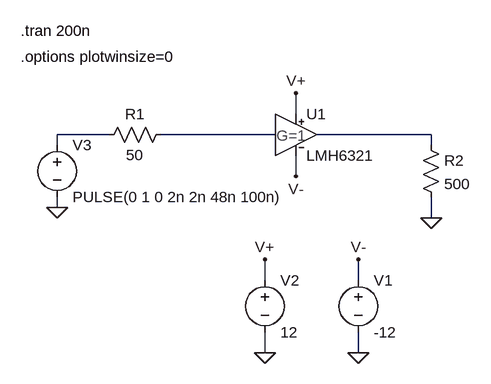
[diagram p0: schematic LM6321_test.asc]
LM6321_test.asc, the LTspice schematic file:
Version 4
SHEET 1 880 680
WIRE 96 160 96 128
WIRE -192 192 -272 192
WIRE 64 192 -112 192
WIRE 304 192 128 192
WIRE -272 208 -272 192
WIRE 304 208 304 192
WIRE 96 256 96 224
WIRE -272 304 -272 288
WIRE 304 320 304 288
WIRE 48 416 48 384
WIRE 192 416 192 384
WIRE 48 528 48 496
WIRE 192 528 192 496
FLAG -272 304 0
FLAG 192 528 0
FLAG 48 528 0
FLAG 48 384 V+
FLAG 192 384 V-
FLAG 96 128 V+
FLAG 96 256 V-
FLAG 304 320 0
SYMBOL LMH6321 96 128 R0
SYMATTR InstName U1
SYMBOL voltage 192 400 R0
SYMATTR InstName V1
SYMATTR Value -12
SYMBOL voltage 48 400 R0
SYMATTR InstName V2
SYMATTR Value 12
SYMBOL voltage -272 192 R0
WINDOW 123 0 0 Left 0
WINDOW 39 0 0 Left 0
SYMATTR InstName V3
SYMATTR Value PULSE(0 1 0 2n 2n 48n 100n)
SYMBOL res -208 208 R270
WINDOW 0 32 56 VTop 0
WINDOW 3 0 56 VBottom 0
SYMATTR InstName R1
SYMATTR Value 50
SYMBOL res 288 192 R0
SYMATTR InstName R2
SYMATTR Value 500
TEXT -328 32 Left 0 !.tran 200n
TEXT -328 72 Left 0 !.options plotwinsize=0

The netlist it stands for:
* LM6321_test.asc
XU1 N002 N003 V- V+ LMH6321  ; pins In+ OUT V- V+
V1 V- 0 -12
V2 V+ 0 12
V3 N001 0 PULSE(0 1 0 2n 2n 48n 100n)
R1 N001 N002 50
R2 N003 0 500
.tran 200n
.options plotwinsize=0
.lib LMH6321.MOD
.backanno
.end